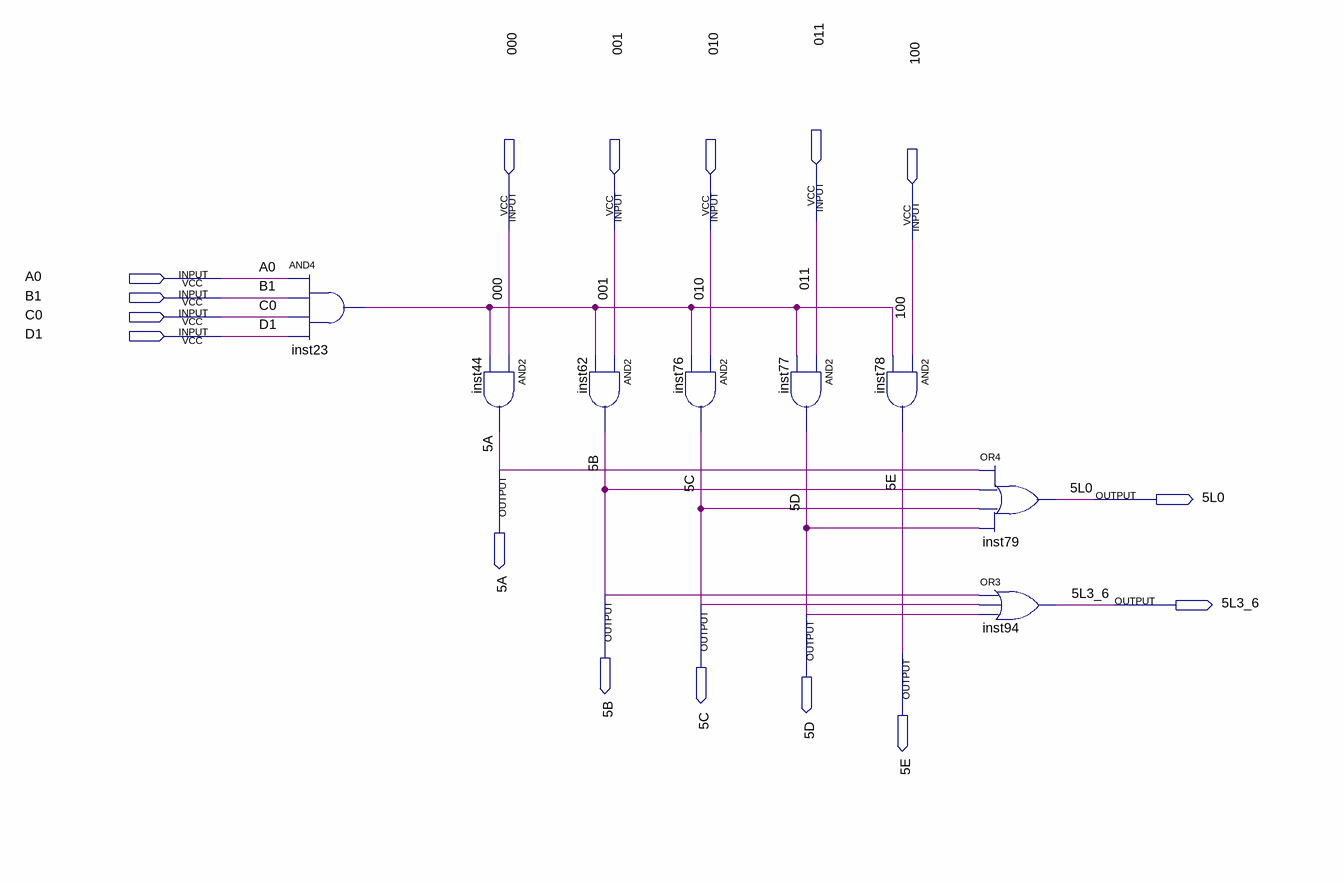
[diagram p0: schematic sheet]
// Quartus schematic carac5.bdf as structural Verilog: 8 symbols, 16 pins
module carac5 (
  input  \011 ,
  input  \000 ,
  input  \001 ,
  input  \010 ,
  input  \100 ,
  input  A0,
  input  B1,
  input  C0,
  input  D1,
  output \5A ,
  output \5L0 ,
  output \5B ,
  output \5C ,
  output \5L3_6 ,
  output \5D ,
  output \5E 
);

  wire inst23_out;

  and inst23 (inst23_out, A0, B1, C0, D1);
  and inst44 (\5A , \000 , inst23_out);
  and inst62 (\5B , \001 , inst23_out);
  and inst76 (\5C , \010 , inst23_out);
  and inst77 (\5D , \011 , inst23_out);
  and inst78 (\5E , \100 , inst23_out);
  or inst79 (\5L0 , \5A , \5B , \5C , \5D );
  or inst94 (\5L3_6 , \5B , \5C , \5D );
endmodule
